# EasyEDA Pro project PRJ_Feeder_V01c.epro, schematic SubBoardLED
Board Name: LEDs; Create Date: 2025-01-07; Page Name: Sense; Project Name: Orion-Feeder; Schematic Name: SubBoardLED; Update Date: 2025-01-07; Company: EasyEDA.com; Page Size: A4; Version: V0.1a
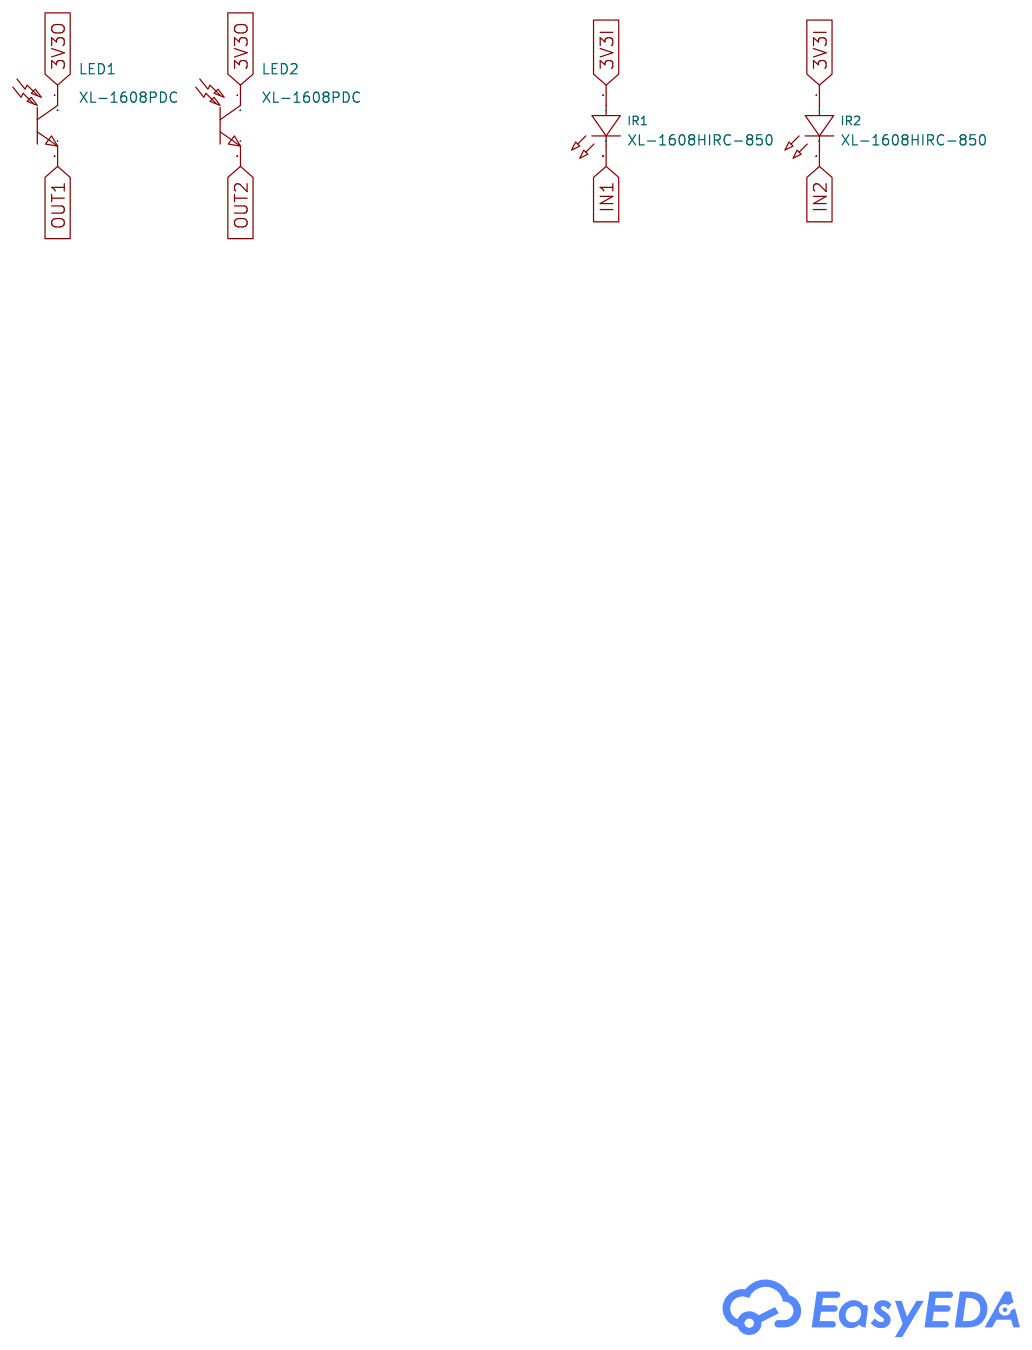
[diagram p0: schematic sheet]

## Parts
IR1  XL-1608HIRC-850  [OPTO-SMD_L1.6-W0.80-RD_XL-1608HIRC-850]
IR2  XL-1608HIRC-850  [OPTO-SMD_L1.6-W0.80-RD_XL-1608HIRC-850]
LED1  XL-1608PDC  [SENSOR-SMD_L1.6-W0.8-XL-1608PDC]
LED2  XL-1608PDC  [SENSOR-SMD_L1.6-W0.8-XL-1608PDC]

## Library data of the parts
IR1 IR2 = XL-1608HIRC-850: Vf - Forward Voltage:1.3V~1.7V Vf - Forward Voltage:1.3V~1.7V Power Dissipation:70mW Wavelength:850nm~860nm Wavelength:850nm~860nm Radiant Intensity: Current - DC Forward (If):30mA Reverse Voltage:5V View Angle:120° Operating Temperature:-30℃~+85℃ Operati; LCSC Part Name: 850nm 30mA红外发射; Supplier Part: C965885; Manufacturer: XINGLIGHT(成兴光); Supplier Footprint: 0603; JLCPCB Part Class: Extended Part; Datasheet: https://atta.szlcsc.com/upload/public/pdf/source/20221102/BD31B8549814085368CE28C247371275.pdf; Supplier: LCSC; Vf - Forward Voltage: 1.3V~1.7V; Power Dissipation: 70mW; Wavelength: 850nm~860nm; Current - DC Forward (If): 30mA; Reverse Voltage: 5V; View Angle: 120°; Operating Temperature: -30℃~+85℃
LED1 LED2 = XL-1608PDC: Transistor Type:NPN Collector Emitter Voltage:30V Collector Emitter Voltage:30V Collector Current (Ic):- Dissipation Power(Max):- Collector Dark Current:150nA Peak Wavelength:880nm Viewing Angle:- Operating Temperature:-25℃~+85℃ Operating Temperature:-25℃; LCSC Part Name: 880nm的NPN光电三极管 A2等级; Supplier Part: C965887; Manufacturer: XINGLIGHT(成兴光); Supplier Footprint: 0603; JLCPCB Part Class: Extended Part; Datasheet: https://atta.szlcsc.com/upload/public/pdf/source/20240218/4D0E7FE37756A418542D3735651A6DF6.pdf; Supplier: LCSC; Transistor Type: NPN; Collector Emitter Voltage: 30V; Collector Dark Current: 150nA; Peak Wavelength: 880nm; Operating Temperature: -25℃~+85℃

## Nets
3V3I: IR1.1(A) IR2.1(A)
3V3O: LED1.1(C) LED2.1(C)
IN1: IR1.2(C)
IN2: IR2.2(C)
OUT1: LED1.2(E)
OUT2: LED2.2(E)
